# EAGLE design lpc134x (EAGLE 5.11)
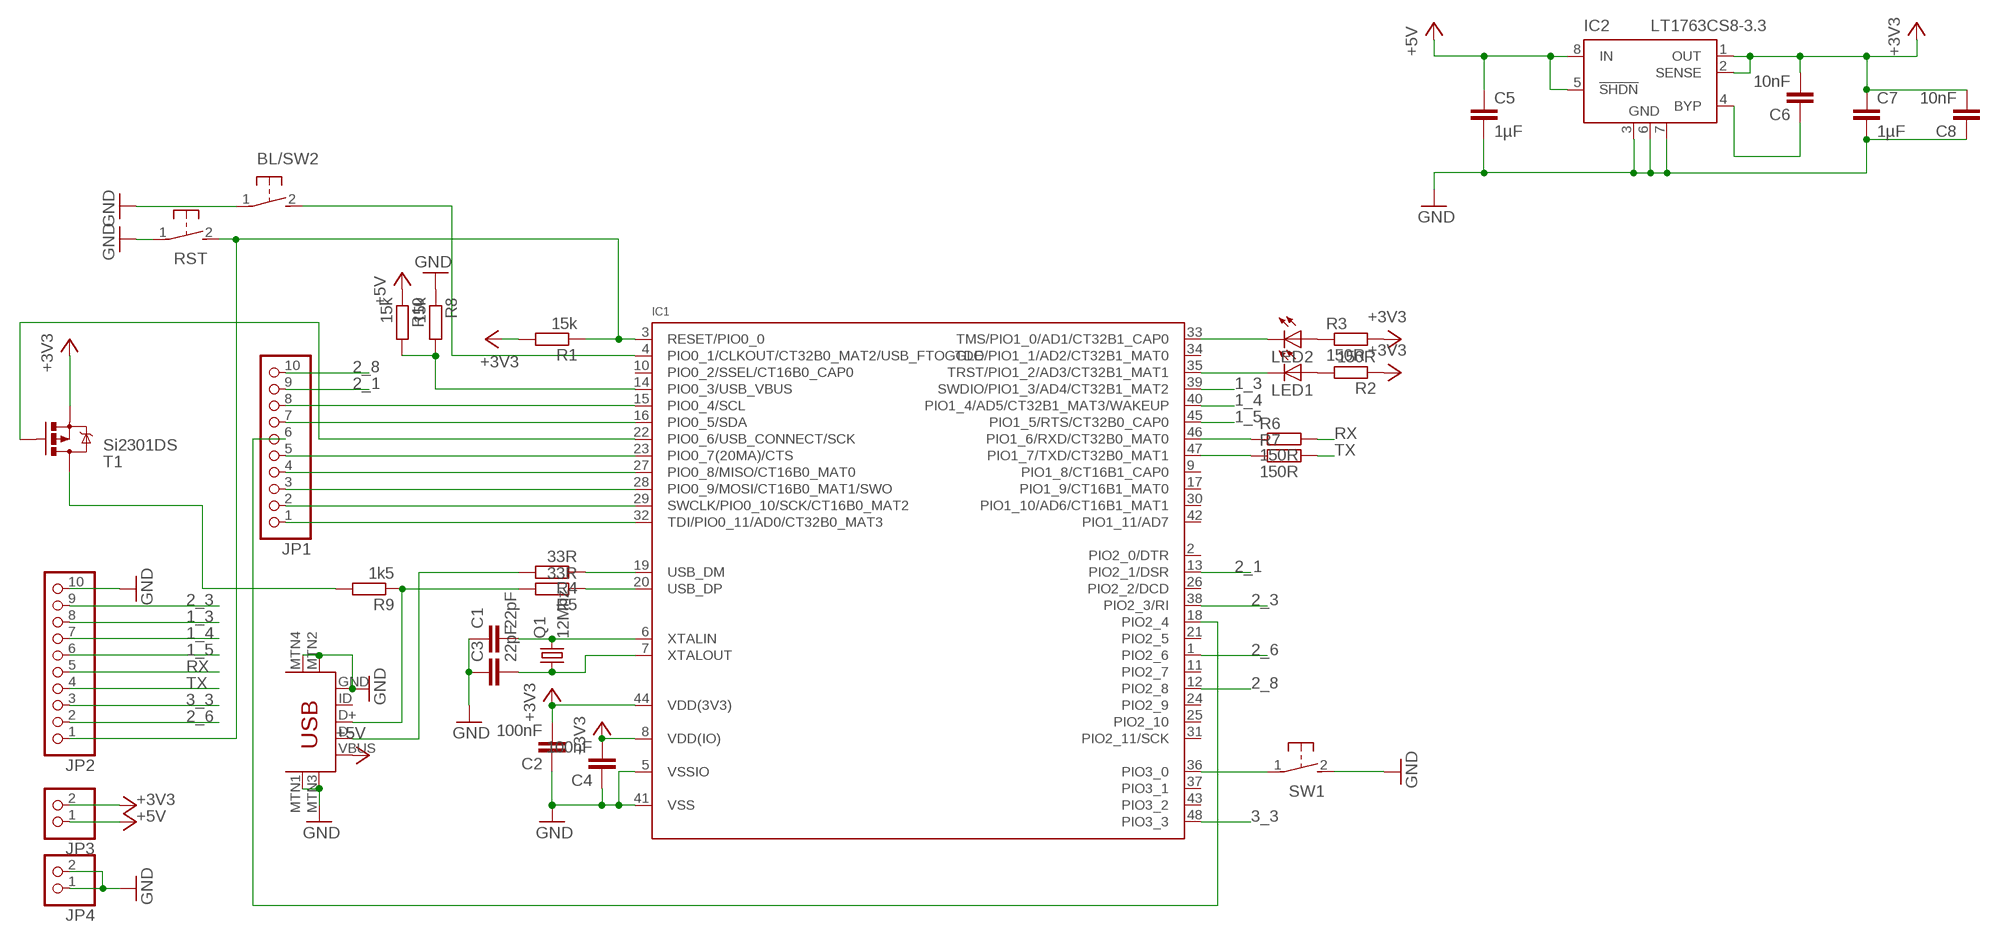
[diagram p0: schematic, sheet 1]

## Parts
BL/SW2  SWITCH_MCTAEF  [SWITCH_MCTAEF]
C1  22pF  C-EUC0402  [C0402]
C2  100nF  C-EUC0402  [C0402]
C3  22pF  C-EUC0402  [C0402]
C4  100nF  C-EUC0402  [C0402]
C5  1µF  CAP0805  [0805]
C6  10nF  C-EUC0402  [C0402]
C7  1µF  CAP0805  [0805]
C8  10nF  C-EUC0402  [C0402]
IC1  LPC1343_QFP  [LQFP48]
IC2  LT1763CS8-3.3  [SOIC8]
JP1  PINHD-1X10_2.54  [1X10]
JP2  PINHD-1X10_2.54  [1X10]
JP3  PINHD-1X02_2.54  [1X02]
JP4  PINHD-1X02_2.54  [1X02]
LED1  LEDCHIPLED_0805  [CHIPLED_0805]
LED2  LEDCHIPLED_0805  [CHIPLED_0805]
Q1  12Mhz  MT-OSCILLATOR  [MT]
R1  15k  R-EU_R0402  [R0402]
R2  150R  R-EU_R0402  [R0402]
R3  150R  R-EU_R0402  [R0402]
R4  33R  R-EU_R0402  [R0402]
R5  33R  R-EU_R0402  [R0402]
R6  150R  R-EU_R0402  [R0402]
R7  150R  R-EU_R0402  [R0402]
R8  15k  R-EU_R0402  [R0402]
R9  1k5  R-EU_R0402  [R0402]
R10  15k  R-EU_R0402  [R0402]
RST  SWITCH_MCTAEF  [SWITCH_MCTAEF]
SW1  SWITCH_MCTAEF  [SWITCH_MCTAEF]
T1  Si2301DS  MOSFET-PCHANNEL  [SOT23]
U$1  USB-MINIB-5PIN  [USB-MINIB]

## Nets
1_3: IC1.39(SWDIO/PIO1_3/AD4/CT32B1_MAT2) JP2.8
1_4: IC1.40(PIO1_4/AD5/CT32B1_MAT3/WAKEUP) JP2.7
1_5: IC1.45(PIO1_5/RTS/CT32B0_CAP0) JP2.6
2_1: IC1.13(PIO2_1/DSR) JP1.9
2_3: IC1.38(PIO2_3/RI) JP2.9
2_6: IC1.1(PIO2_6) JP2.2
2_8: IC1.12(PIO2_8) JP1.10
3_3: IC1.48(PIO3_3) JP2.3
+3V3: C2.2 C4.2 C6.2 C7.1 C8.2 IC1.8(VDD(IO)) IC1.44(VDD(3V3)) IC2.1(OUT) IC2.2(SENSE) JP3.2 R1.2 R2.1 R3.2 T1.2(S)
+5V: C5.1 IC2.5(!SHDN) IC2.8(IN) JP3.1 R10.1 U$1.VBUS
GND: BL/SW2.1 C1.1 C2.1 C3.1 C4.1 C5.2 C7.2 C8.1 IC1.5(VSSIO) IC1.41(VSS) IC2.3(GND) IC2.6(GND) IC2.7(GND) JP2.10 JP4.1 JP4.2 R8.1 RST.1 SW1.2 U$1.GND U$1.MTN1(MTN2) U$1.MTN2(MTN3) U$1.MTN3(MTN1) U$1.MTN4
N$1: IC1.32(TDI/PIO0_11/AD0/CT32B0_MAT3) JP1.1
N$2: IC1.29(SWCLK/PIO0_10/SCK/CT16B0_MAT2) JP1.2
N$3: C3.2 IC1.7(XTALOUT) Q1.1
N$4: C1.2 IC1.6(XTALIN) Q1.3
N$5: IC1.28(PIO0_9/MOSI/CT16B0_MAT1/SWO) JP1.3
N$6: IC1.27(PIO0_8/MISO/CT16B0_MAT0) JP1.4
N$7: IC1.3(RESET/PIO0_0) JP2.1 R1.1 RST.2
N$8: IC1.23(PIO0_7(20MA)/CTS) JP1.5
N$9: IC1.22(PIO0_6/USB_CONNECT/SCK) T1.1(G)
N$10: R5.2 R9.1 U$1.D+
N$11: R4.2 U$1.D-
N$12: IC1.14(PIO0_3/USB_VBUS) R8.2 R10.2
N$13: C6.1 IC2.4(BYP)
N$14: IC1.19(USB_DM) R4.1
N$15: IC1.35(TRST/PIO1_2/AD3/CT32B1_MAT1) LED1.C
N$16: IC1.46(PIO1_6/RXD/CT32B0_MAT0) R6.1
N$17: IC1.47(PIO1_7/TXD/CT32B0_MAT1) R7.1
N$18: LED1.A R2.2
N$19: IC1.36(PIO3_0) SW1.1
N$20: R9.2 T1.3(D)
N$21: BL/SW2.2 IC1.4(PIO0_1/CLKOUT/CT32B0_MAT2/USB_FTOGGLE)
N$22: LED2.A R3.1
N$23: IC1.33(TMS/PIO1_0/AD1/CT32B1_CAP0) LED2.C
N$24: IC1.20(USB_DP) R5.1
N$25: IC1.18(PIO2_4) JP1.6
RX: JP2.5 R6.2
SCL: IC1.15(PIO0_4/SCL) JP1.8
SDA: IC1.16(PIO0_5/SDA) JP1.7
TX: JP2.4 R7.2
Unconnected: IC1.2(PIO2_0/DTR) IC1.9(PIO1_8/CT16B1_CAP0) IC1.10(PIO0_2/SSEL/CT16B0_CAP0) IC1.11(PIO2_7) IC1.17(PIO1_9/CT16B1_MAT0) IC1.21(PIO2_5) IC1.24(PIO2_9) IC1.25(PIO2_10) IC1.26(PIO2_2/DCD) IC1.30(PIO1_10/AD6/CT16B1_MAT1) IC1.31(PIO2_11/SCK) IC1.34(TDO/PIO1_1/AD2/CT32B1_MAT0) IC1.37(PIO3_1) IC1.42(PIO1_11/AD7) IC1.43(PIO3_2) U$1.ID

## Library data of the parts
BL/SW2 RST SW1 = seb:SWITCH_MCTAEF
C1-C4 C6 C8 = rcl:C-EU: CAPACITOR, European symbol
C5 C7 = SparkFun:CAP: Capacitor Standard 0603 ceramic capacitor, and 0.1" leaded capacitor.
IC1 = microbuilder:LPC1343_QFP: LPC1343 72 MHz 32-bit ARM Cortex-M3 microcontroller. 32 kB Flash, 8 kB SRAM, USB Device Mouser: 771-LPC1343FBD48151 Digikey: 568-4945-ND; DIGIKEY#: 568-4945-ND; MANF: NXP; MANF#: LPC1343FBD48,151
IC2 = linear-technology:LT1763CS8: 500mA, Low Noise, LDO Micropower Regulators Source: http://cds.linear.com/docs/Datasheet/1763ff.pdf
JP1 JP2 = pinhead-2:PINHD-1X10: PIN HEADER
JP3 JP4 = pinhead-2:PINHD-1X02: PIN HEADER
LED1 LED2 = led:LED: LED OSRAM: - CHIPLED LG R971, LG N971, LY N971, LG Q971, LY Q971, LO R971, LY R971 LH N974, LH R974 LS Q976, LO Q976, LY Q976 LO Q996 - Hyper CHIPLED LW Q18S LB Q993, LB Q99A, LB R99A - SideLED LS A670, LO A670, LY A670, LG A670, LP A670 LB A673, LV A673, LT A673, LW A673 LH A674 LY A675 LS A676, LA A676, LO A676, LY A676, LW A676 LS A679, LY A679, LG A679 - Hyper Micro SIDELED® LS Y876, LA Y876, LO Y876, LY Y876 LT Y87S - SmartLED LW L88C, LW L88S LB L89C, LB L89S, LG L890 LS L89K, LO L89K, LY L89K LS L896, LA L896, LO L896, LY L896 - TOPLED LS T670, LO T670, LY T670, LG T670, LP T670 LSG T670, LSP T670, LSY T670, LOP T670, LYG T670 LG T671, LOG T671, LSG T671 LB T673, LV T673, LT T673, LW T673 LH T674 LS T676, LA T676, LO T676, LY T676, LB T676, LH T676, LSB T676, LW T676 LB T67C, LV T67C, LT T67C, LS T67K, LO T67K, LY T67K, LW E67C LS E67B, LA E67B, LO E67B, LY E67B, LB E67C, LV E67C, LT E67C LW T67C LS T679, LY T679, LG T679 LS T770, LO T770, LY T770, LG T770, LP T770 LB T773, LV T773, LT T773, LW T773 LH T774 LS E675, LA E675, LY E675, LS T675 LS T776, LA T776, LO T776, LY T776, LB T776 LHGB T686 LT T68C, LB T68C - Hyper Mini TOPLED® LB M676 - Mini TOPLED Santana® LG M470 LS M47K, LO M47K, LY M47K Source: http://www.osram.convergy.de LUXEON: - LUMILED® LXK2-PW12-R00, LXK2-PW12-S00, LXK2-PW14-U00, LXK2-PW14-V00 LXK2-PM12-R00, LXK2-PM12-S00, LXK2-PM14-U00 LXK2-PE12-Q00, LXK2-PE12-R00, LXK2-PE12-S00, LXK2-PE14-T00, LXK2-PE14-U00 LXK2-PB12-K00, LXK2-PB12-L00, LXK2-PB12-M00, LXK2-PB14-N00, LXK2-PB14-P00, LXK2-PB14-Q00 LXK2-PR12-L00, LXK2-PR12-M00, LXK2-PR14-Q00, LXK2-PR14-R00 LXK2-PD12-Q00, LXK2-PD12-R00, LXK2-PD12-S00 LXK2-PH12-R00, LXK2-PH12-S00 LXK2-PL12-P00, LXK2-PL12-Q00, LXK2-PL12-R00 Source: www.luxeon.com KINGBRIGHT: KA-3528ASYC Source: www.kingbright.com
Q1 = seb:MT-OSCILLATOR
R1-R10 = rcl:R-EU_: RESISTOR, European symbol
T1 = SparkFun:MOSFET-PCHANNEL
U$1 = SparkFun:USB-MINIB: Mini-USB "B" connector with 5th pin broken out. Created new symbol breaking out 5th "ID" pin in mini/micro USB connector spec. See: http://en.wikipedia.org/wiki/Mini_usb#Cables. Uses same footprint as 4-pin symbol. Also added pins to connect to mounting / shield pads if required (probably not generally needed as signals aren't shielded once they leave the connector).

## Board
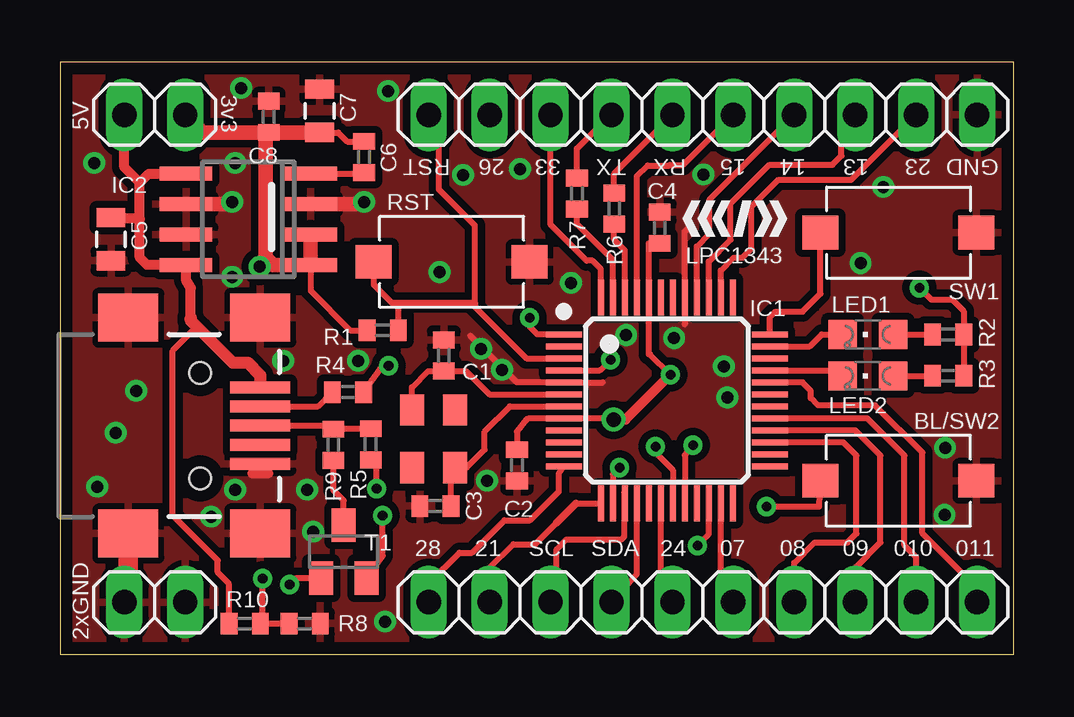
[diagram p1: board, top side]
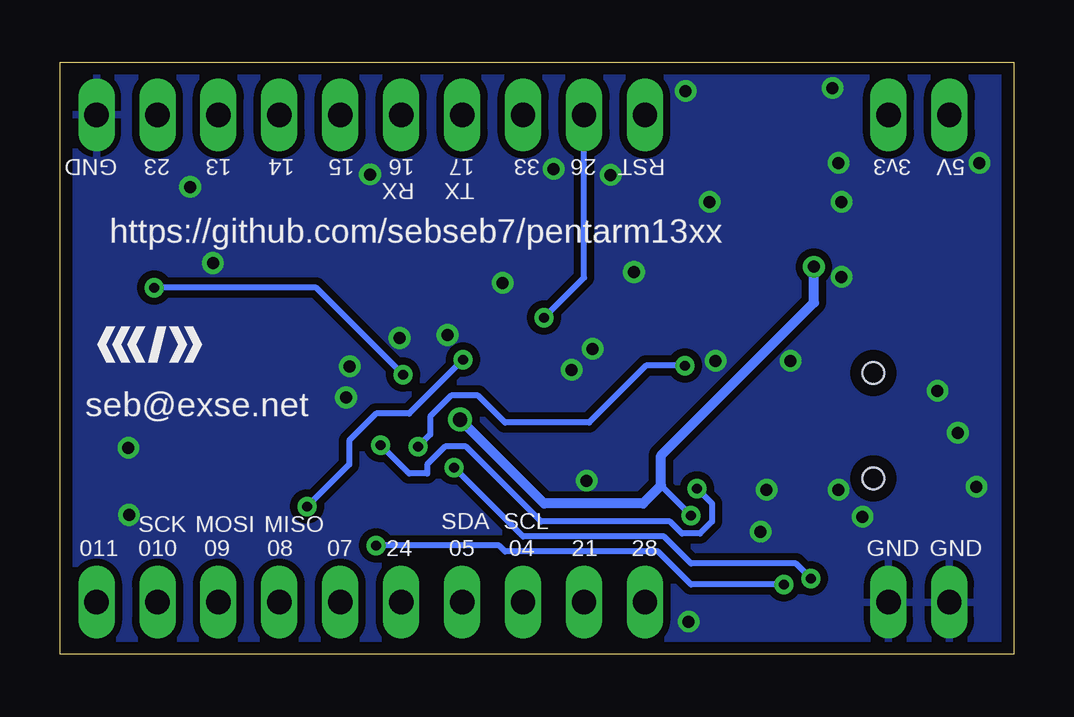
[diagram p2: board, bottom side, seen from below]

Size 39.75 x 24.67 mm. Coordinates in mm from the lower left corner, seen from the top.
Outline: 0,0 39.75,0 39.75,24.67 0,24.67 0,0
Copper layers (1*16): Top 0.035mm / dielectric 1.5mm / Bottom 0.035mm
Design rules "default *": minimum track width 10mil, minimum drill 0.4mm, track to track 8mil, track to pad 8mil, pad to pad 8mil, via to via 8mil, smd to smd 8mil, copper to edge 20mil, drill to drill 8mil, minimum pad ring 10mil, minimum via ring 8mil, stop-mask expansion 4mil, vias tented up to drill 40mil, thermal gap 10mil

### Footprints (pad centres in the part's own frame; a part is rotated, then mirrored left to right if it is on the bottom)
SWITCH_MCTAEF = smd 1.5 x 1.4: 1 -3.25,0; 2 3.25,0
C0402 = smd 0.7 x 0.9: 1 -0.65,0; 2 0.65,0
0805 = smd 0.8 x 1.2: 1 -0.9,0; 2 0.9,0
LQFP48 = smd 1.5 x 0.25: 1 -4.3,2.75; 2 -4.3,2.25; 3 -4.3,1.75; 4 -4.3,1.25; 5 -4.3,0.75; 6 -4.3,0.25; 7 -4.3,-0.25; 8 -4.3,-0.75; 9 -4.3,-1.25; 10 -4.3,-1.75; 11 -4.3,-2.25; 12 -4.3,-2.75; 25 4.3,-2.75; 26 4.3,-2.25; 27 4.3,-1.75; 28 4.3,-1.25; 29 4.3,-0.75; 30 4.3,-0.25; 31 4.3,0.25; 32 4.3,0.75; 33 4.3,1.25; 34 4.3,1.75; 35 4.3,2.25; 36 4.3,2.75 | smd 0.25 x 1.5: 13 -2.75,-4.3; 14 -2.25,-4.3; 15 -1.75,-4.3; 16 -1.25,-4.3; 17 -0.75,-4.3; 18 -0.25,-4.3; 19 0.25,-4.3; 20 0.75,-4.3; 21 1.25,-4.3; 22 1.75,-4.3; 23 2.25,-4.3; 24 2.75,-4.3; 37 2.75,4.3; 38 2.25,4.3; 39 1.75,4.3; 40 1.25,4.3; 41 0.75,4.3; 42 0.25,4.3; 43 -0.25,4.3; 44 -0.75,4.3; 45 -1.25,4.3; 46 -1.75,4.3; 47 -2.25,4.3; 48 -2.75,4.3
SOIC8 = smd 0.6 x 2.2: 1 -1.905,-2.6; 2 -0.635,-2.6; 3 0.635,-2.6; 4 1.905,-2.6; 5 1.905,2.6; 6 0.635,2.6; 7 -0.635,2.6; 8 -1.905,2.6
1X10 = drill 1.016 long: 1 -11.43,0; 2 -8.89,0; 3 -6.35,0; 4 -3.81,0; 5 -1.27,0; 6 1.27,0; 7 3.81,0; 8 6.35,0; 9 8.89,0; 10 11.43,0
1X02 = drill 1.016 long: 1 -1.27,0; 2 1.27,0
CHIPLED_0805 = smd 1.2 x 1.2: A 0,-1.05; C 0,1.05
MT = smd 1.3 x 1: 1 1.2,0.9; 2 -1.2,0.9; 3 -1.2,-0.9; 4 1.2,-0.9
R0402 = smd 0.7 x 0.9: 1 -0.65,0; 2 0.65,0
SOT23 = smd 1 x 1.4: 1 -0.95,-1.1; 2 0.95,-1.1; 3 0,1.1
USB-MINIB = smd 2.5 x 0.5: D+ 2.5,0; D- 2.5,0.8; GND 2.5,-1.6; ID 2.5,-0.8; VBUS 2.5,1.6 | smd 2.5 x 2: MTN1 -3,4.5; MTN2 2.5,4.5; MTN3 -3,-4.5; MTN4 2.5,-4.5 | hole 0.9: 0,2.2; 0,-2.2

### Placement (x,y rotation side)
BL/SW2  34.95,7.23 180 top
C1  16,12.45 270 top
C2  19.05,7.88 90 top
C3  15.65,6.18 0 top
C4  25,17.77 270 top
C5  2.12,17.3 270 top
C6  12.67,20.72 90 top
C7  10.82,22.65 90 top
C8  8.7,22.4 270 top
IC1  25.3,10.58 0 top
IC2  7.85,18.12 90 top
JP1  26.8,2.17 180 top
JP2  26.8,22.48 0 top
JP3  3.95,22.48 0 top
JP4  3.95,2.17 0 top
LED1  33.68,13.33 90 top
LED2  33.68,11.6 90 top
Q1  15.57,8.97 270 top
R1  13.45,13.5 180 top
R2  37.03,13.33 180 top
R3  37.03,11.6 0 top
R4  12,10.93 180 top
R5  12.95,8.75 90 top
R6  23.1,18.57 90 top
R7  21.55,19.2 90 top
R8  10.2,1.27 180 top
R9  11.4,8.72 270 top
R10  7.7,1.27 0 top
RST  16.32,16.35 180 top
SW1  34.95,17.57 0 top
T1  11.82,4.28 0 top
U$1  5.85,9.53 0 top

### Tracks (layer width: path | path; a pad name or v marks a point on that pad's centre or on a via)
1_3
  Top 0.254: IC1.39 27.05,16.38 27.95,17.27 27.95,18.77 29.57,20.4 32.2,20.4 32.58,20.77 32.58,21.91 JP2.8
1_4
  Top 0.254: IC1.40 26.55,17 27.07,17.52 27.07,18.95 JP2.7
1_5
  Top 0.254: JP2.6 25.97,20.39 25.41,20.39 25.4,20.38 24.5,20.38 24.05,19.92 IC1.45
2_1
  Top 0.254: JP1.9 17.91,3.58 18.9,4.58 19.8,4.58 20.7,5.48 | 21.5,6.28 IC1.13
  Top 0.305: 20.7,5.48 21.5,6.28
2_3
  Top 0.254: IC1.38 27.55,16 28.07,16.52 28.45,16.52 28.82,16.9 28.82,18.65 29.95,19.77 32.98,19.77 JP2.9
2_6  (via drill 0.4)
  Top 0.254: IC1.1 19.9,13.33 19.57,13.65 v19.57,14.03
  Bottom 0.254: v19.57,14.03 17.91,15.69 JP2.2
2_8
  Top 0.254: JP1.10 15.37,2.94 16.65,4.23 17.18,4.23 18.52,5.58 19.6,5.58 20.8,6.78 20.8,7.53 IC1.12
3_3
  Top 0.254: IC1.48 22.55,16.05 22.2,16.4 21.95,16.4 20.45,17.9 JP2.3
+3V3  (via drill 0.4, 0.5, 0.6)
  Top 0.254: C2.2 19.05,9.28 19.45,9.78 19.57,9.83 IC1.8 23.02,9.83 v23.07,9.78 23.05,9.75 | C4.2 24.55,17.12 IC1.44 24.55,12.5 24.6,12.5 v25.45,11.65 | R1.2 12.1,13.5 10.45,15.15 IC2.1 | R2.1 37.55,13.15 | v35.83,15.28 36.33,14.78 37.2,14.78 37.68,14.3 R2.1 | R2.1 R3.2 | T1.2 13.45,4.1 v13.45,5.78 | C7.1 11.6,21.75 11.97,21.38 C6.2
  Top 0.406: v23.07,9.78 23.57,9.78 v25.45,11.65 | v8.32,16.15 8.57,16.27
  Top 0.61: IC2.2 IC2.1 8.88,16.22 8.57,16.52 | C8.2 C7.1 | C8.2 5.96,21.75 JP3.2 | 8.57,16.52 8.57,21.62 C8.2 | 8.57,16.27 8.57,16.52
  Bottom 0.254: v23.07,9.78 22.95,9.78 | v35.83,15.28 29.07,15.28 v25.45,11.65 | v13.45,5.78 14.7,7.03
  Bottom 0.406: v23.07,9.78 19.57,6.28 15.45,6.28 14.7,7.03 14.7,8.28 8.32,14.65 v8.32,16.15
+5V
  Top 0.254: 5.83,13.53 5.58,13.53 4.7,12.65 4.7,5.78 6.58,3.9 6.58,3.4 7.05,2.92 R10.1
  Top 0.406: 5.45,14.03 5.45,15.28 5.25,15.6 IC2.8 3.63,16.22 3.33,16.52 3.33,18.15 | IC2.5 3.71,20.03 3.33,19.65 | 3.33,18.15 3.33,19.65 | C5.1 2.1,18.15 3.33,18.15 | JP3.1 2.68,20.29 3.33,19.65
  Top 0.5: U$1.VBUS 8.35,11.62 7.83,12.15 7.2,12.15 5.83,13.53 5.45,13.9 5.45,14.03
GND  (via drill 0.5)
  Top 0.254: 26.3,17.88 26.05,17.62 IC1.41 26.05,13.75 | 17.1,13.28 19.05,11.33 IC1.5 22.62,11.33 | 8.02,7.53 8.29,7.93 U$1.GND
  Top 0.4: 8.02,7.53 8.7,7.53
  Top 0.61: IC2.6 6.95,18.76 | IC2.3 12.32,18.76
  Top 0.813: JP4.1 2.85,2.33 U$1.MTN3
  other vias: 13.55,1.35 36.9,8.6 36.88,5.8 34.33,19.47 33.38,16.3 27.82,10.7 27.68,12 15.82,15.92 26.82,20 25.6,13.18 6.3,5.73 1.42,20.47 3.17,10.97 12.42,12.22 7.17,15.72 12.67,18.85 18.43,11.85 17.55,12.72 9.3,12.22 23.6,13.3 1.55,6.98 13.67,23.47 7.3,6.85 10.55,5.1 10.3,6.85 16.8,19.97 19.18,20.22 21.3,15.47 17.8,7.23 7.55,23.6 7.17,18.85 7.3,20.47 2.33,9.22
  pour Top (isolate 0.305): -0.15,0.4 39.75,0.28 39.75,27.02 -0.15,27.15
  pour Bottom (isolate 0.305): -0.18,0.4 39.75,0.28 39.75,27.02 -0.18,27.15
N$1
  Top 0.254: IC1.32 30.95,11.33 31.3,10.97 31.3,10.68 31.6,10.38 33.98,10.38 35.95,8.4 35.95,5.03 38.23,2.75 JP1.1
N$2
  Top 0.254: JP1.2 35.69,4.04 35.2,4.53 35.2,8.28 33.65,9.83 IC1.29
N$3
  Top 0.254: IC1.7 18.75,10.33 17.7,9.28 17.7,8.53 16.95,7.78 Q1.1 16.3,7.48 C3.2
N$4
  Top 0.254: IC1.6 17.9,10.83 16.93,11.8 C1.2 15.35,11.8 14.67,11.12 Q1.3
N$5
  Top 0.254: JP1.3 33.15,3.6 34.2,4.65 34.2,8.28 33.15,9.33 IC1.28
N$6
  Top 0.254: JP1.4 30.61,3.81 31.45,4.65 32.83,4.65 33.2,5.03 33.2,8.28 32.65,8.83 IC1.27
N$7
  Top 0.254: 17.3,14.65 17.3,14.47 19.45,12.33 IC1.3 | 17.3,14.65 17.3,17.88 15.8,19.38 15.8,21.82 15.37,22.25 JP2.1 | R1.1 14.1,14.55 14.2,14.65 | 14.2,14.65 17.3,14.65 | 14.2,14.65 13.82,14.65 13.07,15.4 RST.2
N$8
  Top 0.254: JP1.5 27.53,2.81 27.55,2.83 IC1.23
N$9  (via drill 0.4)
  Top 0.254: IC1.22 27.05,5 v26.57,4.53 | v9.57,2.9 9.85,3.17 T1.1
  Bottom 0.254: v26.57,4.53 21.45,4.53 21.2,4.28 14.82,4.28 13.45,2.9 v9.57,2.9
N$10
  Top 0.254: U$1.D+ 11.3,9.53 R9.1 11.42,9.4 R5.2
N$11
  Top 0.254: U$1.D- 10.75,10.33 R4.2
N$12  (via drill 0.4)
  Top 0.254: v23.32,7.78 23.05,7.5 IC1.14 | 8.22,1.27 R10.2 | R10.2 R8.2 | R10.2 8.45,1.38 v8.45,3.15
  Bottom 0.254: v23.32,7.78 20.45,4.9 14.57,4.9 13.45,3.77 9.07,3.77 v8.45,3.15
N$13
  Top 0.254: IC2.4 12.48,20.03 C6.1
N$14  (via drill 0.4)
  Top 0.254: R4.1 13.42,12 v13.7,12.03 | v24.82,8.65 24.82,8.4 25.55,7.68 IC1.19
  Bottom 0.254: v24.82,8.65 24.32,9.15 24.32,9.9 23.45,10.78 22.32,10.78 21.2,9.65 17.7,9.65 15.32,12.03 v13.7,12.03
N$15
  Top 0.254: IC1.35 31.25,12.83 31.75,13.33 LED1.C
N$16
  Top 0.254: IC1.46 23.55,16.82 23.1,17.27 R6.1
N$17
  Top 0.254: IC1.47 23.05,16.42 21.55,17.92 R7.1
N$18
  Top 0.254: LED1.A R2.2
N$19
  Top 0.254: IC1.36 29.6,14.05 29.82,14.28 30.95,14.28 31.7,15.03 SW1.1
N$20
  Top 0.254: T1.3 11.82,6.4 11.57,6.65 11.4,6.83 R9.2
N$21  (via drill 0.4)
  Top 0.254: IC1.4 22.5,11.83 v22.95,12.28 | v29.45,6.15 31.65,6.15 BL/SW2.2
  Bottom 0.254: v22.95,12.28 25.2,10.03 26.57,10.03 27.7,8.9 27.7,7.9 v29.45,6.15
N$22
  Top 0.254: LED2.A R3.1 36.58,11.6
N$23
  Top 0.254: IC1.33 32.43,11.83 LED2.C
N$24  (via drill 0.4)
  Top 0.254: R5.1 13.2,7.85 v13.2,6.9 | IC1.20 26.05,8.3 v26.39,8.71
  Bottom 0.254: 26.07,8.4 v26.39,8.71 25.2,7.53 24.45,7.53 24.45,7.9 23.7,8.65 22.82,8.65 19.7,5.53 14.32,5.53 13.82,5.03 13.07,5.03 12.57,5.53 12.57,6.28 v13.2,6.9
N$25
  Top 0.254: JP1.6 25.05,2.65 IC1.18
RX
  Top 0.254: JP2.5 25.43,22.35 23.1,20.02 R6.2
SCL
  Top 0.254: JP1.8 20.7,2.52 20.7,4.38 21.1,4.78 23.4,4.78 23.53,4.91 23.53,6.76 IC1.15
SDA
  Top 0.254: JP1.7 24.03,3.31 24.05,3.33 IC1.16
TX
  Top 0.254: JP2.4 22.89,22.41 21.55,21.07 R7.2

### Text on the board
bPlace: https://github.com/sebseb7/pentarm13xx | seb@exse.net
tNames: 3v3 | 5V | RST | 26 | 33 | TX | RX | 15 | 14 | 13 | 23 | GND | LPC1343 | 28 | 21 | SCL | SDA | 24 | 07 | 08 | 09 | 010 | 011 | 2xGND
bNames: 5V | 3v3 | RST | 26 | 33 | 17 | 16 | 15 | 14 | 13 | 23 | GND | TX | RX | SCL | SDA | MISO | MOSI | SCK | GND | GND | 28 | 21 | 04 | 05 | 24 | 07 | 08 | 09 | 010 | 011